# EAGLE design lademodul (EAGLE 7.7.0)
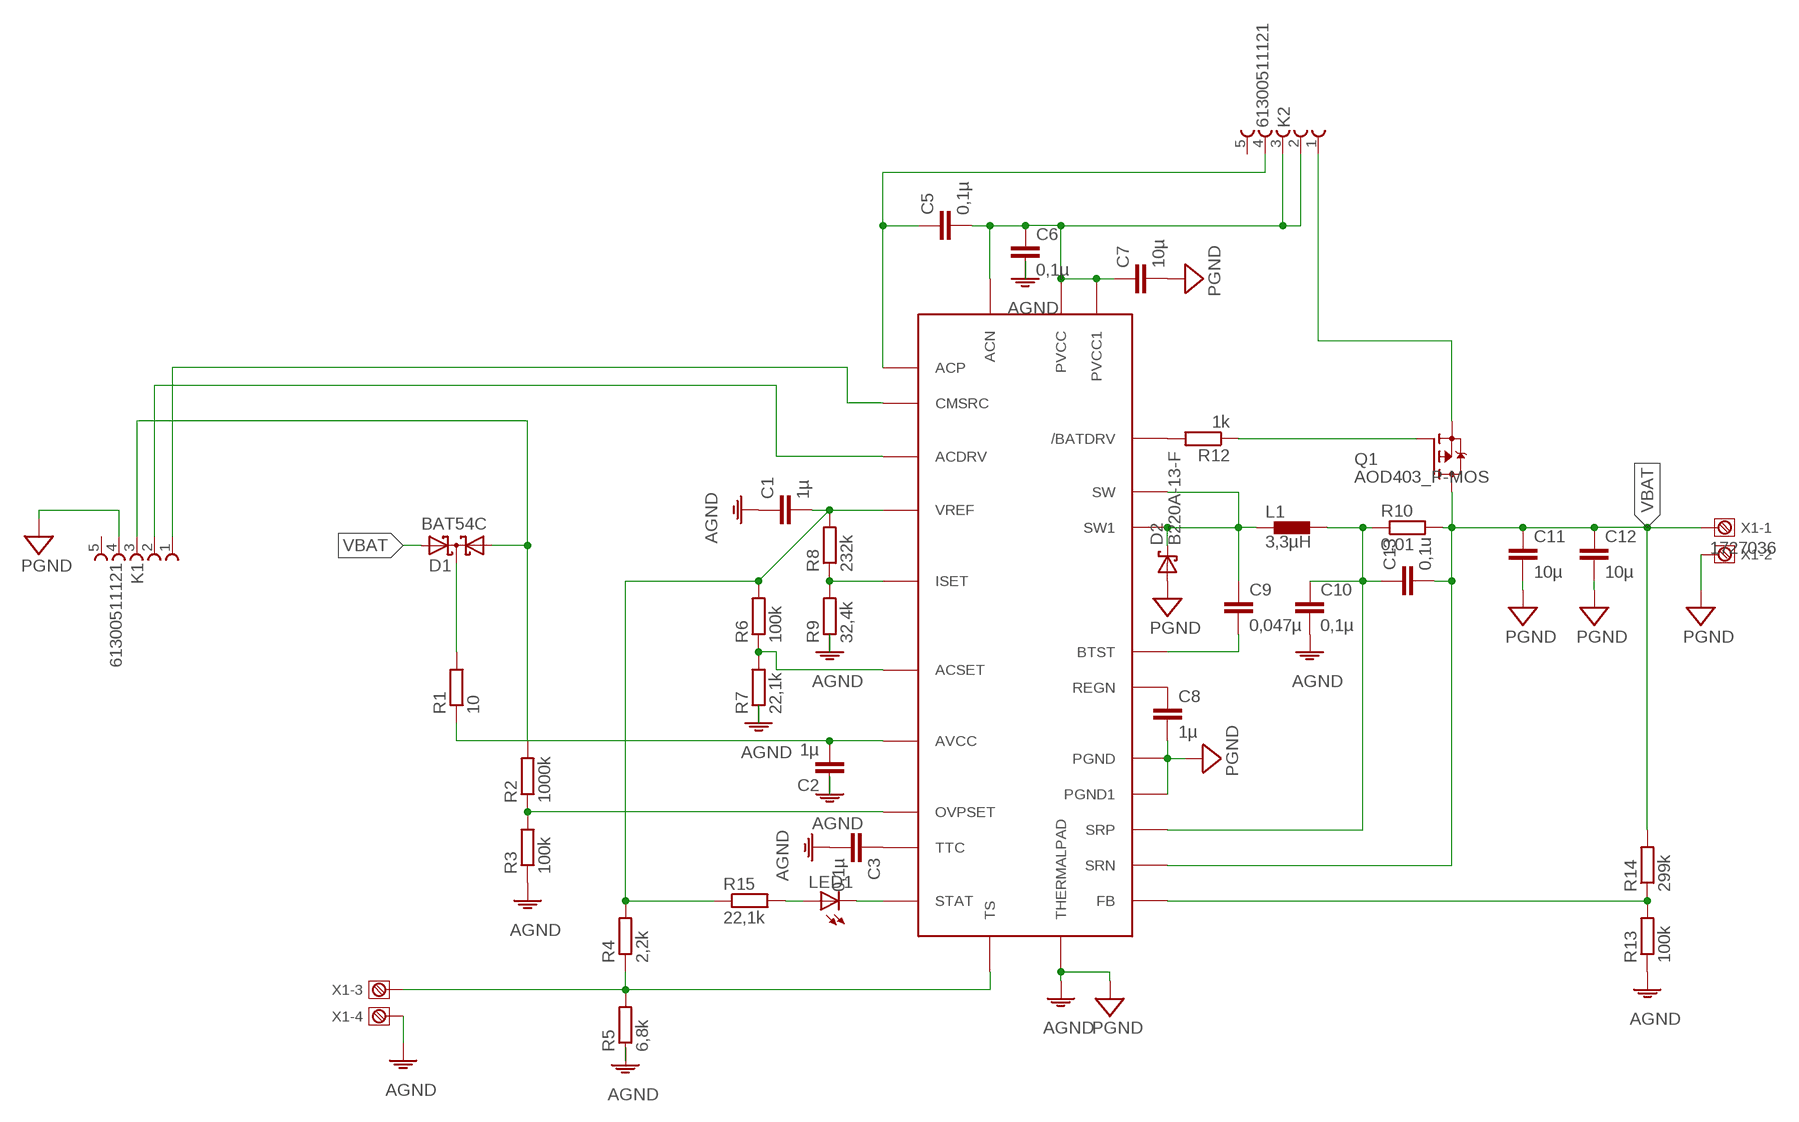
[diagram p0: schematic, sheet 1]

## Parts
C1  1µ  C-EUC0603  [C0603]
C2  1µ  C-EUC0603  [C0603]
C3  0,1µ  C-EUC0603  [C0603]
C5  0,1µ  C-EUC0603  [C0603]
C6  0,1µ  C-EUC0603  [C0603]
C7  10µ  C-EUC0603  [C0603]
C8  1µ  C-EUC0603  [C0603]
C9  0,047µ  C-EUC0603  [C0603]
C10  0,1µ  C-EUC0603  [C0603]
C11  10µ  C-EUC0603  [C0603]
C12  10µ  C-EUC0603  [C0603]
C13  0,1u  C-EUC0603  [C0603]
D1  BAT54C  [SOT23]
D2  B220A-13-F  [SMA]
IC1  BQ24171  [R-PVQFN-N24]
K1  61300511121  [61300511121]
K2  61300511121  [61300511121]
L1  3,3µH  L  [L]
LED1  LEDCHIP-LED0603  [CHIP-LED0603]
Q1  AOD403_P-MOS  SPD30P06PTO252  [TO252]
R1  10  R-EU_R1206  [R1206]
R2  1000k  R-EU_R0603  [R0603]
R3  100k  R-EU_R0603  [R0603]
R4  2,2k  R-EU_R0603  [R0603]
R5  6,8k  R-EU_R0603  [R0603]
R6  100k  R-EU_R0603  [R0603]
R7  22,1k  R-EU_R0603  [R0603]
R8  232k  R-EU_R0603  [R0603]
R9  32,4k  R-EU_R0603  [R0603]
R10  0,01  R-EU_R1206  [R1206]
R12  1k  R-EU_R0603  [R0603]
R13  100k  R-EU_R0603  [R0603]
R14  299k  R-EU_R0603  [R0603]
R15  22,1k  R-EU_R0603  [R0603]
X1  1727036  [1727036]

## Nets
AGND: C1.1 C2.1 C3.2 C6.2 C10.2 IC1.THERMALPAD R3.1 R5.1 R7.1 R9.1 R13.1 X1.4 ; supply symbol labelled PGND
N$1: IC1.18(OVPSET) R2.1 R3.2
N$2: IC1.10(TS) R4.1 R5.2 X1.3
N$3: D1.1(A1) K1.3 R2.2
N$4: IC1.13(ISET) R8.1 R9.2
N$5: C1.2 IC1.12(VREF) R4.2 R6.2 R8.2 R15.1
N$6: C3.1 IC1.11(TTC)
N$7: C8.1 IC1.20(REGN)
N$8: IC1.17(ACSET) R6.1 R7.2
N$9: IC1.7(CMSRC) K1.1
N$10: IC1.8(ACDRV) K1.2
N$11: C2.2 IC1.4(AVCC) R1.1
N$12: C5.1 IC1.6(ACP) K2.4
N$13: IC1.9(STAT) LED1.C
N$13_VBAT: K2.1 Q1.2(S)
N$15: IC1.19(/BATDRV) R12.2
N$16: Q1.1(G) R12.1
N$17: C9.2 IC1.21(BTST)
N$19: IC1.14(FB) R13.2 R14.1
N$20: D1.3(CC) R1.2
N$21: LED1.A R15.2
PGND: C7.2 C8.2 C11.2 C12.2 D2.A IC1.22(PGND) IC1.23(PGND1) K1.4 X1.2
PVCC: C5.2 C6.1 C7.1 IC1.2(PVCC) IC1.3(PVCC1) IC1.5(ACN) K2.2 K2.3
SRP: C10.1 C13.1 IC1.16(SRP) L1.P$2 R10.1
SW: C9.1 D2.C(K) IC1.1(SW) IC1.24(SW1) L1.P$1
VBAT: C11.1 C12.1 C13.2 D1.2(A2) IC1.15(SRN) Q1.3(D) R10.2 R14.2 X1.1
Unconnected: K1.5 K2.5

## Library data of the parts
C1-C3 C5-C13 = untitled:C-EU: CAPACITOR, European symbol
D1 = diode:BAT54C: Schottky Diodes Source: Fairchild .. BAT54.pdf
D2 = Lademodul:B220A-13-F
IC1 = untitled:BQ24171
K1 K2 = Board_to_Board_Connectors_rev15d:61300511121: WR-PHD 2.54mm Pin Header, 5 Pin =>Code : Con_BTB_PHD_2.54_1_THT_61300511121 <http://katalog.we-online.de/media/images/eican/Con_BTB_PHD_2.54_1_THT_6130xx11121_pf2.jpg> Details see: http://katalog.we-online.de/en/em/613_0xx_111_21 Created 2014-05-29, Karrer Zheng 2014 (C) Würth Elektronik
L1 = Lademodul:L
LED1 = 0_HTL_MegaCard_V3:LED: LED OSRAM: - CHIPLED LG R971, LG N971, LY N971, LG Q971, LY Q971, LO R971, LY R971 LH N974, LH R974 LS Q976, LO Q976, LY Q976 LO Q996 - Hyper CHIPLED LW Q18S LB Q993, LB Q99A, LB R99A - SideLED LS A670, LO A670, LY A670, LG A670, LP A670 LB A673, LV A673, LT A673, LW A673 LH A674 LY A675 LS A676, LA A676, LO A676, LY A676, LW A676 LS A679, LY A679, LG A679 - Hyper Micro SIDELED® LS Y876, LA Y876, LO Y876, LY Y876 LT Y87S - SmartLED LW L88C, LW L88S LB L89C, LB L89S, LG L890 LS L89K, LO L89K, LY L89K LS L896, LA L896, LO L896, LY L896 - TOPLED LS T670, LO T670, LY T670, LG T670, LP T670 LSG T670, LSP T670, LSY T670, LOP T670, LYG T670 LG T671, LOG T671, LSG T671 LB T673, LV T673, LT T673, LW T673 LH T674 LS T676, LA T676, LO T676, LY T676, LB T676, LH T676, LSB T676, LW T676 LB T67C, LV T67C, LT T67C, LS T67K, LO T67K, LY T67K, LW E67C LS E67B, LA E67B, LO E67B, LY E67B, LB E67C, LV E67C, LT E67C LW T67C LS T679, LY T679, LG T679 LS T770, LO T770, LY T770, LG T770, LP T770 LB T773, LV T773, LT T773, LW T773 LH T774 LS E675, LA E675, LY E675, LS T675 LS T776, LA T776, LO T776, LY T776, LB T776 LHGB T686 LT T68C, LB T68C - Hyper Mini TOPLED® LB M676 - Mini TOPLED Santana® LG M470 LS M47K, LO M47K, LY M47K Source: http://www.osram.convergy.de/
Q1 = transistor-fet:SPD30P06P: SIPMOS(R) Power-Transistor P-Channel, Enhancement mode Source: http://www.infineon.com/upload/Document/cmc_upload/documents/012/3615/SPD_U30P06P.pdf
R1-R10 R12-R15 = untitled:R-EU_: RESISTOR, European symbol
X1 = con-phoenix-3.81:1727036: MKDS 1/4-3,81 Source: http://eshop.phoenixcontact.de; MF: FARNELL; MPN: 1727036; OC_FARNELL: 3704592; OC_NEWARK: 71C4114

## Board
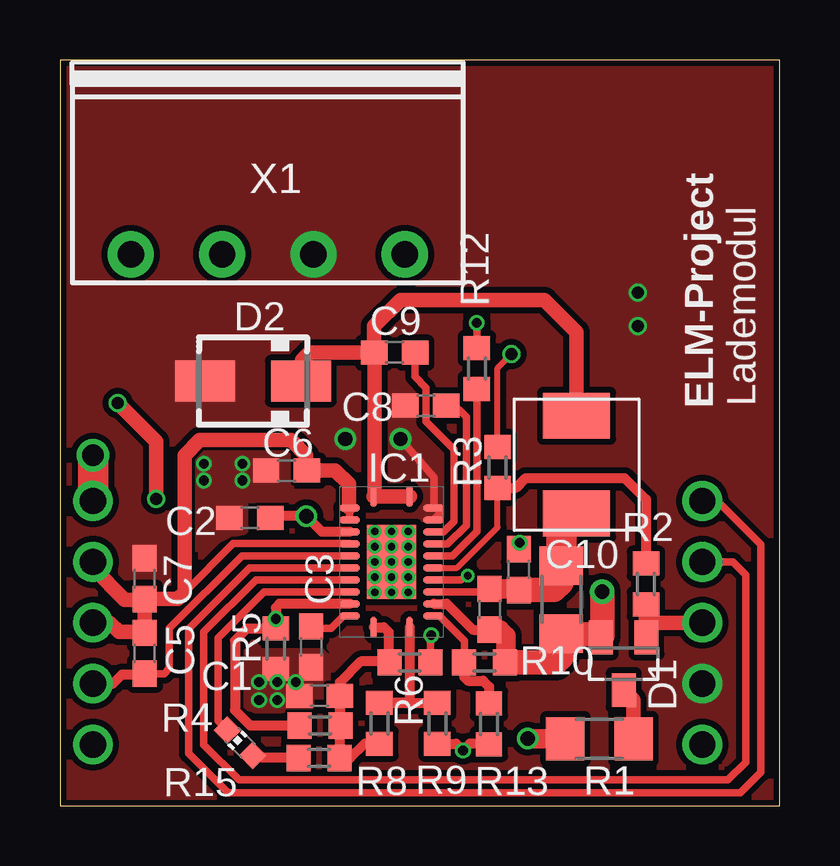
[diagram p1: board, top side]
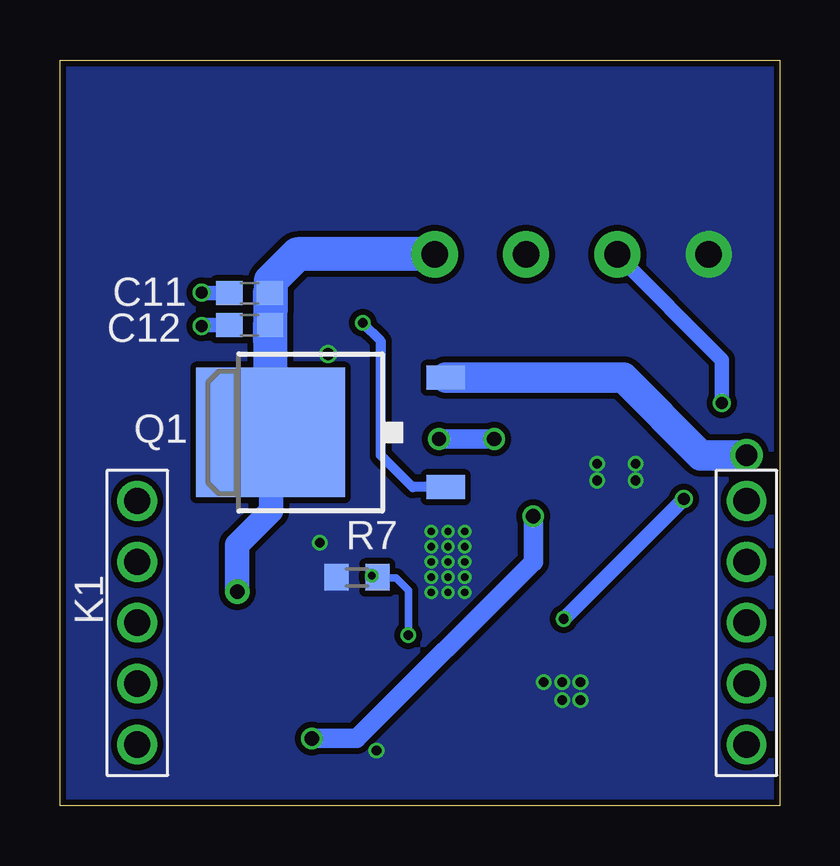
[diagram p2: board, bottom side, seen from below]

Size 30 x 31.1 mm. Coordinates in mm from the lower left corner, seen from the top.
Outline: 0,0 30,0 30,31.1 0,31.1 0,0
Copper layers (1*16): Top 0.018mm / dielectric 1.55mm / Bottom 0.018mm
Design rules "Multi-CB_2L_125um-Tracks_OL35um": minimum track width 0.125mm, minimum drill 0.2mm, track to track 0.125mm, track to pad 0.125mm, pad to pad 0.125mm, via to via 0.125mm, smd to smd 0mil, copper to edge 0.2mm, drill to drill 0.2mm, minimum pad ring 0.125mm, minimum via ring 0.125mm, stop-mask expansion 2mil, vias tented up to drill 0.45mm, thermal gap 0.2mm

### Footprints (pad centres in the part's own frame; a part is rotated, then mirrored left to right if it is on the bottom)
C0603 = smd 1.1 x 1: 1 -0.85,0; 2 0.85,0
SOT23 = smd 1 x 1.4: 1 -0.95,-1.1; 2 0.95,-1.1; 3 0,1.1
SMA = smd 2.5 x 1.7: A 2,0; C -2,0
R-PVQFN-N24 = smd 0.85 x 0.28: 1 -2.725,-0.75; 12 2.725,-0.75; 13 2.725,0.75; 24 -2.725,0.75 | smd 0.28 x 0.85: 2 -2.25,-1.75; 3 -1.75,-1.75; 4 -1.25,-1.75; 5 -0.75,-1.75; 6 -0.25,-1.75; 7 0.25,-1.75; 8 0.75,-1.75; 9 1.25,-1.75; 10 1.75,-1.75; 11 2.25,-1.75; 14 2.25,1.75; 15 1.75,1.75; 16 1.25,1.75; 17 0.75,1.75; 18 0.25,1.75; 19 -0.25,1.75; 20 -0.75,1.75; 21 -1.25,1.75; 22 -1.75,1.75; 23 -2.25,1.75 | smd 3.1 x 2.05: THERMALPAD 0,0
61300511121 = drill 1.1: 1 -5.08,0; 2 -2.54,0; 3 0,0; 4 2.54,0; 5 5.08,0
L = smd 1.915 x 2.79: P$1 2.038,0; P$2 -2.038,0
CHIP-LED0603 = smd 0.8 x 0.8: A 0,-0.75; C 0,0.75
TO252 = smd 1 x 1.6: 1 -2.28,-4.8; 2 2.28,-4.8 | smd 5.4 x 6.2: 3 0,2.5
R1206 = smd 1.6 x 1.803: 1 -1.422,0; 2 1.422,0
R0603 = smd 1 x 1.1: 1 -0.85,0; 2 0.85,0
1727036 = drill 1.1 pad 1.93: 1 -5.08,8; 2 -1.27,8; 3 2.54,8; 4 6.35,8

### Placement (x,y rotation side)
C1  10.82,4.59 0 top
C2  7.92,12.02 0 top
C3  10.47,6.64 270 top
C5  3.54,6.37 90 top
C6  9.44,13.98 180 top
C7  3.54,9.48 90 top
C8  15.25,16.68 180 top
C9  13.95,18.9 0 top
C10  19.13,9.85 90 top
C11  22.09,20.04 180 bottom
C12  22.09,21.37 180 bottom
C13  17.9,8.2 270 top
D1  23.5,5.93 180 top
D2  8.05,17.71 180 top
IC1  13.83,10.18 270 top
K1  26.78,7.63 270 bottom
K2  1.38,7.63 270 bottom
L1  21.54,14.23 90 top
LED1  7.51,2.63 45 top
Q1  18.72,15.57 90 bottom
R1  22.49,2.8 0 top
R2  24.43,9.25 270 top
R3  18.25,14.11 270 top
R4  10.84,3.35 0 top
R5  9,6.56 90 top
R6  14.59,5.98 180 top
R7  17.62,9.53 0 bottom
R8  13.32,3.44 270 top
R9  15.73,3.44 90 top
R10  20.9,8.6 270 top
R12  17.38,18.24 270 top
R13  17.89,3.42 90 top
R14  17.7,5.98 0 top
R15  10.8,2 180 top
X1  9.3,31 180 top

### Tracks (layer width: path | path; a pad name or v marks a point on that pad's centre or on a via)
AGND  (via drill 0.3, 0.4, 0.5)
  Top 0.254: R3.1 18.25,18.26 v18.83,18.85
  Top 0.305: C10.2 19.13,10.94 v19.16,10.97
  Top 0.406: R13.1 17.89,2.59 17.09,2.59 v16.8,2.31 16.51,2.59 R9.1
  other vias: 13.13,11.45 13.83,11.45 13.13,10.81 14.52,11.45 13.83,10.81 14.52,10.81 13.13,10.18 13.13,9.54 13.83,10.18 13.83,9.54 14.52,10.18 14.52,9.54 13.13,8.9 13.83,8.9 14.52,8.9 8.3,4.41 8.3,5.17 9.06,5.17 9.06,4.41 9.83,5.17 6,14.27 7.6,14.27 6,13.57 7.6,13.57
  pour Bottom (isolate 0.25, no thermals): 0,31.1 30,31.1 30,0 0,0
  pour Top (no thermals): 10.9,6.37 7.82,6.37 7.82,4.18 8.14,4.06 8.93,4.06 9.23,4.07 10.4,4.17 10.4,4.65 11.1,4.65 11.1,6.17
  pour Top (no thermals): 5.62,14.53 5.62,10.67 7.07,11.41 7.67,11.51 7.67,12.84 9.56,12.84 9.56,14.68 6.08,14.78
N$1
  Top 0.254: IC1.18 16.56,9.93 18.25,11.61 R3.2
  Top 0.406: R3.2 19.01,13.26 19.41,13.67 23.54,13.67 24.43,12.78 R2.1
N$2  (via drill 0.4, 0.5)
  Top 0.305: R5.2
  Top 0.406: IC1.10 9.15,8.43 9,8.27 v9,7.8 R5.2 | R4.1 7.93,3.35 7.29,3.99 7.29,6.89 7.8,7.4 R5.2
  Top 0.61: v4,12.8 4,15.2 v2.4,16.8
  Bottom 0.61: v9,7.8 v4,12.8 | v2.4,16.8 2.4,18.59 6.76,22.95 X1.3
N$3
  Top 0.61: R2.2 24.43,7.6 | 24.43,7.6 24.43,7.05 D1.1 | K1.3 24.46,7.63 24.43,7.6
N$4
  Top 0.406: R9.2 R8.1 14.58,4.31 IC1.13
N$5
  Top 0.305: 11.67,3.88 C1.2 | R4.2 11.64,3.32 11.65,3.31 | R8.2
  Top 0.406: IC1.12 13.5,7.45 13.7,7.25 13.7,6.02 | 13.7,6.02 R6.2 | 13.7,6.02 12.53,6.02 11.67,5.16 11.67,3.88 | C1.2 11.64,3.32 | 11.65,3.31 R15.1 12.1,2 12.7,2.6 R8.2
N$6
  Top 0.305: IC1.11 11.82,7.92 11.3,7.4 10.47,7.4
  Top 0.406: 10.5,7.44 C3.1 10.47,7.4
N$7
  Top 0.305: IC1.20 16.16,10.93 16.94,11.7 16.94,16.21 16.26,16.88 C8.1
N$8  (via drill 0.3, 0.4)
  Top 0.305: R6.1 15.44,7.09 v15.48,7.13 | IC1.17 16.73,9.43 v17,9.6
  Bottom 0.305: v15.48,7.13 15.48,8.98 16,9.5 16.74,9.5 R7.2 | 17.14,9.5 R7.2 | v17,9.6 16.8,9.5 R7.2
N$9
  Top 0.305: IC1.7 7.91,9.93 5.36,7.38 5.36,2.19 7,0.55 28.37,0.55 29.22,1.4 29.22,10.91 27.41,12.71 K1.1
N$10
  Top 0.305: IC1.8 8.17,9.43 6,7.25 6,2.55 7.46,1.08 27.85,1.08 28.59,1.82 28.59,9.64 28.05,10.18 K1.2
N$11  (via drill 0.6)
  Top 0.406: C2.2 8.64,12.08 v10.27,12.08 10.93,11.43 IC1.4
  Top 0.61: 19.52,2.8 v19.51,2.81
  Top 0.813: R1.1 19.52,2.8
  Bottom 0.813: v19.51,2.81 17.64,2.81 10.27,10.18 v10.27,12.08
N$12
  Top 0.305: C5.1 4.34,5.51 4.55,5.73 4.55,7.4 7.58,10.43 IC1.6
  Top 0.406: K2.4 2.21,5.09 2.59,5.48 3.5,5.48 C5.1
N$13
  Top 0.305: IC1.9 8.52,8.93 6.6,7.01 6.6,3.54 LED1.C
N$13_VBAT  (via drill 0.9)
  Top 1.27: v1.38,14.62 K2.1
  Bottom 1.27: Q1.2 6.52,17.85 3.29,14.62 v1.38,14.62
N$15
  Top 0.305: IC1.19 16.36,10.43 17.38,11.45 R12.2
N$16  (via drill 0.4)
  Top 0.305: v17.38,20.14 R12.1
  Bottom 0.406: Q1.1 15.29,13.29 16.62,14.62 16.62,19.37 v17.38,20.14
N$17
  Top 0.305: C9.2 14.8,17.9 15.27,17.43 15.27,16.02 16.43,14.87 16.43,11.86 15.99,11.43 IC1.21
N$18
  Top 0.61: 14.6,12.9 13.1,12.9
N$19
  Top 0.305: R13.2 | IC1.14 15.82,7.92 16.87,6.87 16.87,6.01 R14.1
  Top 0.406: R14.1 16.85,5.37 17,5.22 17.64,5.22 17.89,4.97 R13.2
N$20
  Top 0.61: D1.3 23.91,4.42 R1.2
N$21
  Top 0.305: 8.14,2 LED1.A
  Top 0.406: R15.2 8.14,2
PGND  (via drill 0.5, 0.6)
  Top 0.305: v14.2,15.3 15.6,13.7 15.6,12.45 IC1.23 15.78,12.43 15.8,12.4 15.8,12.15 IC1.22
  Bottom 0.254: 24.07,21.38 v24.1,21.4 | 24.06,20.04 v24.1,20
  Bottom 0.61: C12.2 24.07,21.38 | C11.2 24.06,20.04
  Bottom 0.813: v14.2,15.3 v11.9,15.3
  pour Top (isolate 0.25, no thermals): 0,31.1 30,31.1 30,0 0,0
PVCC
  Top 0.305: IC1.5 12.06,10.94 7.22,10.94 5.19,8.9 | IC1.3 IC1.2
  Top 0.406: 3.5,7.25 C5.2 | 12.05,12.45 IC1.2 | 10.27,14.01 C6.1
  Top 0.61: K2.3 2.08,7.63 2.46,7.25 3.5,7.25 | C5.2 C7.1 | C6.1 11.48,13.98 12.05,13.41 12.05,12.45 | 10.27,14.01 10.27,14.62 9.63,15.26 5.83,15.26 5.19,14.62 5.19,8.9 4.91,8.63 C7.1 | K2.2 1.38,9.92 2.7,8.6 3.51,8.6 C7.1
SRP
  Top 0.305: IC1.16 17.88,8.93
  Top 0.406: 17.88,8.93 C13.1
  Top 0.61: 19.09,9.05 C10.1
  Top 0.813: C13.1 19.09,9.05
  Top 1.016: C10.1 20.6,9 20.9,9.3 R10.1
  Top 1.27: R10.1 20.9,11.56 L1.P$2
SW
  Top 0.305: IC1.24
  Top 0.61: IC1.24 IC1.1 13.1,12.93 C9.1 | L1.P$1 21.54,19.77 20.2,21.1 14.2,21.1 13.1,20 C9.1 | C9.1 10.4,18.9 10.1,18.6 10.1,17.46 D2.C
VBAT  (via drill 0.6 pad 1.02)
  Top 0.305: 18,7.35 C13.2
  Top 0.406: IC1.15 16.14,8.43 17.21,7.35 18,7.35
  Top 0.61: 22.61,7.09 D1.2 22.43,7.15
  Top 0.813: 18,7.35 18.35,7.35 18.6,7.1 18.6,6.04 R14.2
  Top 1.016: v22.61,8.94 22.61,7.09 | R14.2 20.68,5.98 20.9,6.2 R10.2 22.43,7.15
  Bottom 0.61: 21.2,15.56 Q1.3
  Bottom 1.016: v22.61,8.94 22.61,10.89 21.2,12.3 21.2,15.56
  Bottom 1.422: Q1.3 21.24,15.6 C11.1 21.24,19.44 C12.1 21.21,20.7 21.21,21.88 20.1,23 X1.1

### Text on the board
tNames: ELM-Project | Lademodul